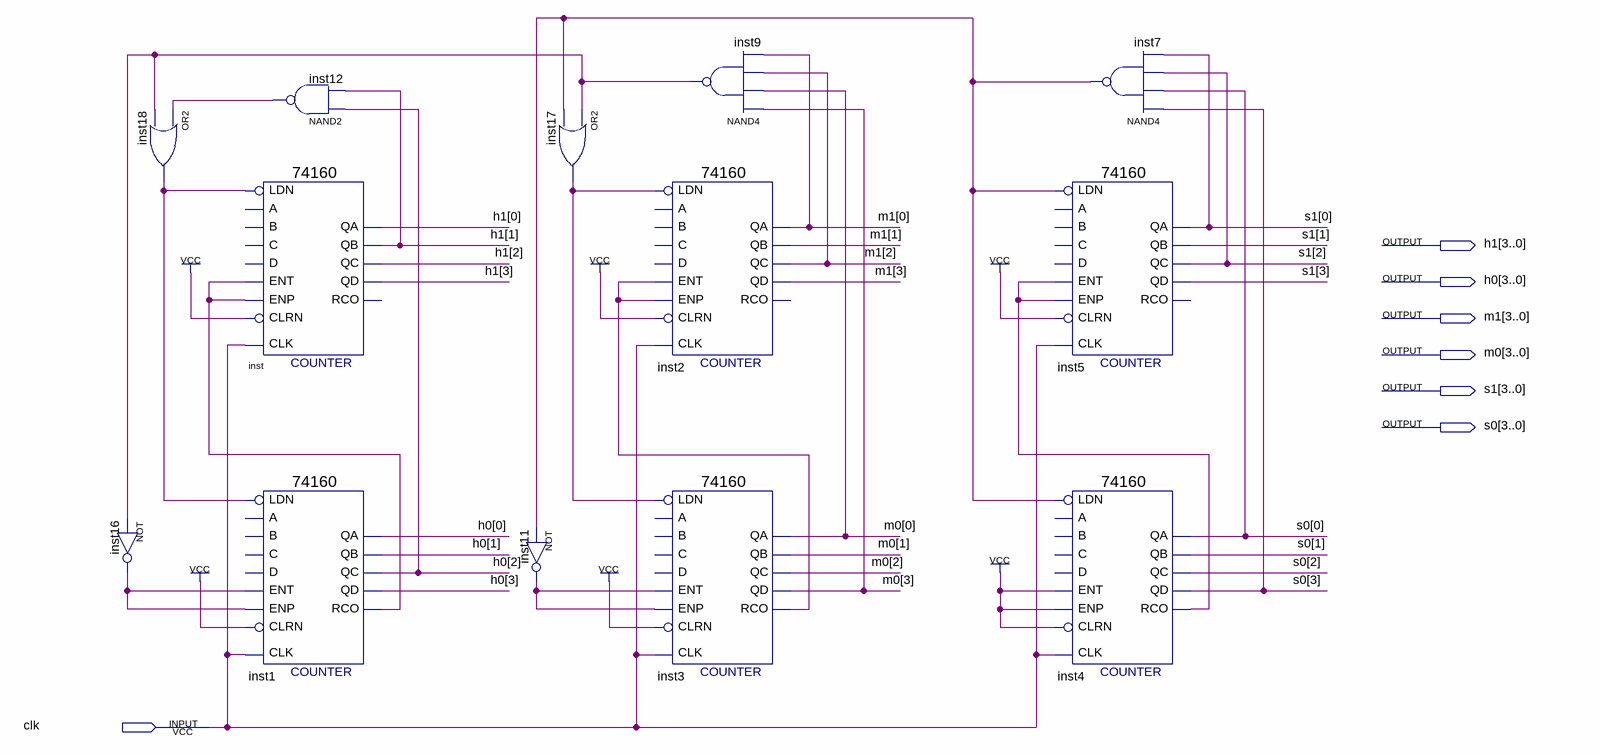
[diagram p0: schematic sheet]
// Quartus schematic cnt.bdf as structural Verilog: 13 symbols, 7 pins
module cnt (
  input  clk,
  output [3:0] h1,
  output [3:0] h0,
  output [3:0] m1,
  output [3:0] m0,
  output [3:0] s1,
  output [3:0] s0
);

  wire inst1_rco, inst3_rco, inst4_rco, inst7_out, inst9_out, inst11_out, inst12_out, inst16_out, inst17_out,
       inst18_out;

  not inst16 (inst16_out, inst9_out);
  or inst18 (inst18_out, inst12_out, inst9_out);
  \74160  inst (
    .CLK(clk), .ENT(inst1_rco), .LDN(inst18_out), .ENP(inst1_rco), .CLRN(1'b1), .QD(h1[3]), .QA(h1[0]),
    .QB(h1[1]), .QC(h1[2]));  // open: A, B, C, D, RCO
  \74160  inst1 (
    .CLK(clk), .ENT(inst16_out), .LDN(inst18_out), .ENP(inst16_out), .CLRN(1'b1), .QD(h0[3]), .QA(h0[0]),
    .QB(h0[1]), .QC(h0[2]), .RCO(inst1_rco));  // open: A, B, C, D
  nand inst12 (inst12_out, h0[2], h1[1]);
  or inst17 (inst17_out, inst9_out, inst7_out);
  not inst11 (inst11_out, inst7_out);
  nand inst9 (inst9_out, m0[3], m0[0], m1[2], m1[0]);
  \74160  inst2 (
    .CLK(clk), .ENT(inst3_rco), .LDN(inst17_out), .ENP(inst3_rco), .CLRN(1'b1), .QD(m1[3]), .QA(m1[0]),
    .QB(m1[1]), .QC(m1[2]));  // open: A, B, C, D, RCO
  \74160  inst3 (
    .CLK(clk), .ENT(inst11_out), .LDN(inst17_out), .ENP(inst11_out), .CLRN(1'b1), .QD(m0[3]), .QA(m0[0]),
    .QB(m0[1]), .QC(m0[2]), .RCO(inst3_rco));  // open: A, B, C, D
  \74160  inst5 (
    .CLK(clk), .ENT(inst4_rco), .LDN(inst7_out), .ENP(inst4_rco), .CLRN(1'b1), .QD(s1[3]), .QA(s1[0]),
    .QB(s1[1]), .QC(s1[2]));  // open: A, B, C, D, RCO
  \74160  inst4 (
    .CLK(clk), .ENT(1'b1), .LDN(inst7_out), .ENP(1'b1), .CLRN(1'b1), .QD(s0[3]), .QA(s0[0]), .QB(s0[1]),
    .QC(s0[2]), .RCO(inst4_rco));  // open: A, B, C, D
  nand inst7 (inst7_out, s0[3], s0[0], s1[2], s1[0]);
endmodule
